# EAGLE design shift-register (EAGLE 7.4.0)
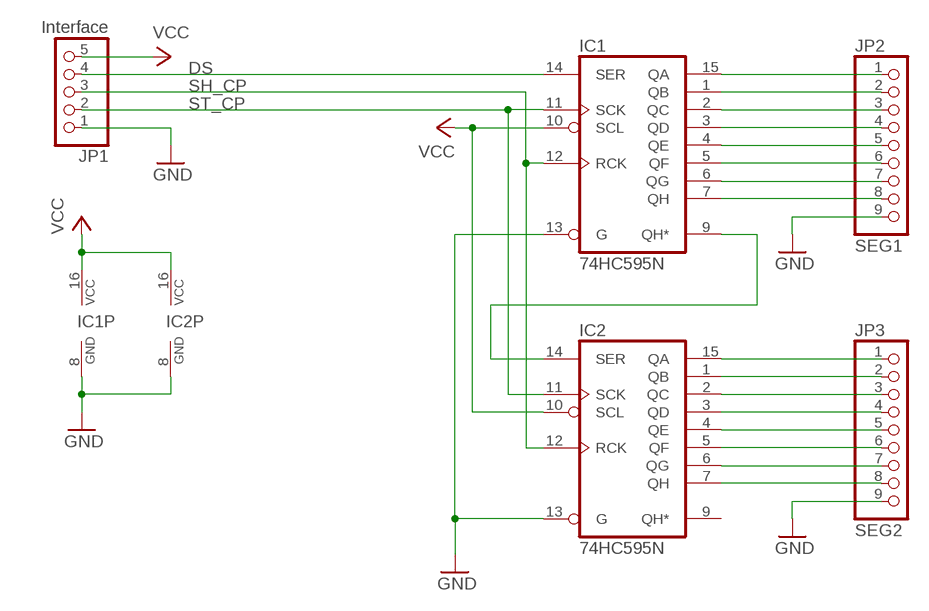
[diagram p0: schematic, sheet 1]

## Parts
IC1  74HC595N  [DIL16]
IC2  74HC595N  [DIL16]
JP1  Interface  PINHD-1X5  [1X05]
JP2  SEG1  PINHD-1X9  [1X09]
JP3  SEG2  PINHD-1X9  [1X09]

## Nets
DS: IC1.14(SER) JP1.4
GND: IC1.8(GND) IC1.13(G) IC2.8(GND) IC2.13(G) JP1.1 JP2.9 JP3.9
N$1: IC1.9(QH*) IC2.14(SER)
N$2: IC1.15(QA) JP2.1
N$3: IC1.1(QB) JP2.2
N$4: IC1.2(QC) JP2.3
N$5: IC1.3(QD) JP2.4
N$6: IC1.4(QE) JP2.5
N$7: IC1.5(QF) JP2.6
N$8: IC1.6(QG) JP2.7
N$9: IC1.7(QH) JP2.8
N$10: IC2.15(QA) JP3.1
N$11: IC2.1(QB) JP3.2
N$12: IC2.2(QC) JP3.3
N$13: IC2.3(QD) JP3.4
N$14: IC2.4(QE) JP3.5
N$15: IC2.5(QF) JP3.6
N$16: IC2.6(QG) JP3.7
N$17: IC2.7(QH) JP3.8
SH_CP: IC1.12(RCK) IC2.12(RCK) JP1.3
ST_CP: IC1.11(SCK) IC2.11(SCK) JP1.2
VCC: IC1.10(SCL) IC1.16(VCC) IC2.10(SCL) IC2.16(VCC) JP1.5
Unconnected: IC2.9(QH*)

## Library data of the parts
IC1 IC2 = 74xx-eu:74*595: 8-bit SHIFT REGISTER, output latch
JP1 = pinhead:PINHD-1X5: PIN HEADER
JP2 JP3 = pinhead:PINHD-1X9: PIN HEADER

## Net classes
0 default: clearance 0.305 mm

## Board
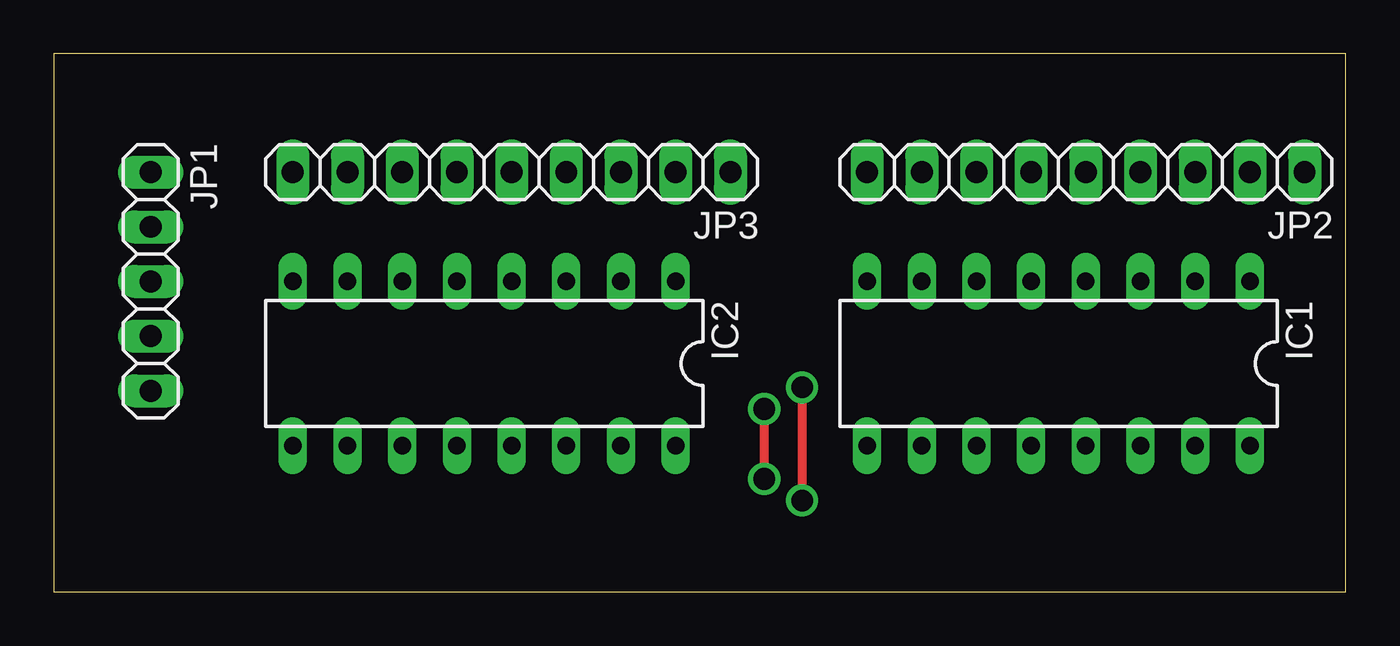
[diagram p1: board, top side]
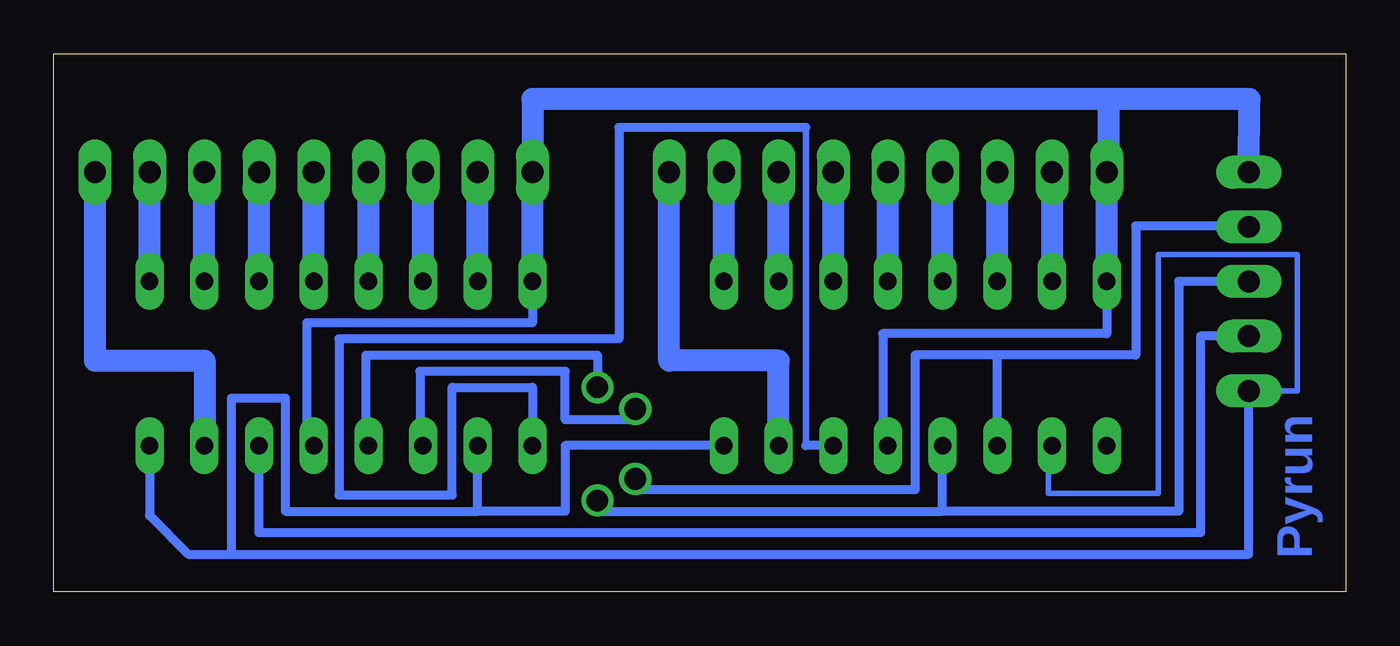
[diagram p2: board, bottom side, seen from below]

Size 60 x 25 mm. Coordinates in mm from the lower left corner, seen from the top.
Outline: 0,0 60,0 60,25 0,25 0,0
Copper layers (1*16): Top 0.035mm / dielectric 1.5mm / Bottom 0.035mm
Design rules "default": minimum track width 10mil, minimum drill 24mil, track to track 8mil, track to pad 8mil, pad to pad 8mil, via to via 8mil, smd to smd 8mil, copper to edge 40mil, drill to drill 8mil, minimum pad ring 10mil, minimum via ring 8mil, stop-mask expansion 4mil, vias tented up to drill 0mil, thermal gap 10mil

### Footprints (pad centres in the part's own frame; a part is rotated, then mirrored left to right if it is on the bottom)
DIL16 = drill 0.813 long: 1 -8.89,-3.81; 2 -6.35,-3.81; 3 -3.81,-3.81; 4 -1.27,-3.81; 5 1.27,-3.81; 6 3.81,-3.81; 7 6.35,-3.81; 8 8.89,-3.81; 9 8.89,3.81; 10 6.35,3.81; 11 3.81,3.81; 12 1.27,3.81; 13 -1.27,3.81; 14 -3.81,3.81; 15 -6.35,3.81; 16 -8.89,3.81
1X05 = drill 1.016 long: 1 -5.08,0; 2 -2.54,0; 3 0,0; 4 2.54,0; 5 5.08,0
1X09 = drill 1.016 long: 1 -10.16,0; 2 -7.62,0; 3 -5.08,0; 4 -2.54,0; 5 0,0; 6 2.54,0; 7 5.08,0; 8 7.62,0; 9 10.16,0

### Placement (x,y rotation side)
IC1  46.66,10.61 180 top
IC2  19.99,10.61 180 top
JP1  4.5,14.42 270 top
JP2  47.93,19.5 180 top
JP3  21.26,19.5 180 top

### Tracks (layer width: path | path; a pad name or v marks a point on that pad's centre or on a via)
DS
  Bottom 0.406: JP1.4 6.75,11.88 6.75,2.75 50.47,2.75 IC1.14
GND
  Bottom 0.406: IC2.8 11.1,12 21.5,12 21.5,6.8 IC2.13 | IC1.8 37.77,12.5 48.25,12.5 48.25,6.8 IC1.13
  Bottom 1.016: IC2.8 JP3.9 11,19.5 11,22.9 | IC1.8 JP2.9 37.77,22.9 11,22.9 | JP1.1 4.47,22.9 11,22.9
N$1
  Bottom 0.305: 25.07,6.8 25.07,21.57
  Bottom 0.406: IC2.14 25.07,6.8 | 25.07,21.57 33.75,21.57 33.75,11.75 46.75,11.75 46.75,4.5 41.5,4.5 41.5,9.5 37.77,9.5 IC1.9
N$2
  Bottom 1.016: JP2.1 58.09,10.75 53,10.75 IC1.15
N$3
  Bottom 1.016: IC1.1 JP2.2
N$4
  Bottom 1.016: IC1.2 JP2.3
N$5
  Bottom 1.016: IC1.3 JP2.4
N$6
  Bottom 1.016: IC1.4 JP2.5
N$7
  Bottom 1.016: IC1.5 JP2.6
N$8
  Bottom 1.016: IC1.6 JP2.7
N$9
  Bottom 1.016: IC1.7 JP2.8
N$10
  Bottom 1.016: IC2.15 26.34,10.75 31.42,10.75 JP3.1
N$11
  Bottom 1.016: IC2.1 JP3.2
N$12
  Bottom 1.016: IC2.2 JP3.3
N$13
  Bottom 1.016: IC2.3 JP3.4
N$14
  Bottom 1.016: IC2.4 JP3.5
N$15
  Bottom 1.016: IC2.5 JP3.6
N$16
  Bottom 1.016: IC2.6 JP3.7
N$17
  Bottom 1.016: JP3.8 IC2.7
SH_CP  (via drill 1 pad 1.27)
  Top 0.406: v34.75,9.5 v34.75,4.25
  Bottom 0.406: JP1.3 7.75,14.42 7.75,3.75 18.72,3.75 | 18.72,3.75 IC2.12 | IC1.12 45.5,6.8 45.5,11 34.75,11 v34.75,9.5 | 18.72,3.75 34.75,3.75 v34.75,4.25
ST_CP  (via drill 1 pad 1.27)
  Top 0.406: v33,5.25 v33,8.5
  Bottom 0.406: JP1.2 4.75,17 9.75,17 9.75,11 16.18,11 | IC2.11 16.18,11 | 16.18,11 20,11 20,4.75 33,4.75 v33,5.25 | v33,8.5 33,8 36.25,8 36.25,10.25 43,10.25 43,6.8 IC1.11
VCC
  Bottom 0.254: JP1.5 2.25,9.34 2.25,15.68 8.7,15.68 8.7,4.58 13.8,4.58 13.8,6.8 IC2.10
  Bottom 0.406: IC1.16 55.55,3.55 53.75,1.75 51.75,1.75 | 51.75,1.75 4.5,1.75 JP1.5 | 51.75,1.75 51.75,9 49.25,9 49.25,3.75 40.31,3.75 | 40.31,3.75 IC1.10 | IC2.16 36.25,6.8 36.25,3.75 40.31,3.75

### Text on the board
Bottom: Pyrun